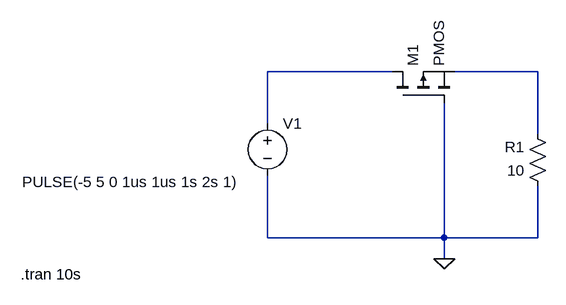
[diagram p0: schematic pmos.asc]
pmos.asc, the LTspice schematic file:
Version 4
SHEET 1 880 680
WIRE 304 -80 112 -80
WIRE 528 -80 400 -80
WIRE 112 0 112 -80
WIRE 528 16 528 -80
WIRE 112 176 112 80
WIRE 384 176 384 -32
WIRE 384 176 112 176
WIRE 528 176 528 96
WIRE 528 176 384 176
WIRE 384 208 384 176
FLAG 384 208 0
SYMBOL voltage 112 -16 R0
WINDOW 3 -378 106 Left 2
WINDOW 123 0 0 Left 2
WINDOW 39 0 0 Left 2
SYMATTR InstName V1
SYMATTR Value PULSE(-5 5 0 1us 1us 1s 2s 1)
SYMBOL res 544 112 R180
WINDOW 0 36 76 Left 2
WINDOW 3 36 40 Left 2
SYMATTR InstName R1
SYMATTR Value 10
SYMBOL pmos 304 -32 R270
SYMATTR InstName M1
TEXT -268 232 Left 2 !.tran 10s

The netlist it stands for:
* pmos.asc
V1 N001 0 PULSE(-5 5 0 1us 1us 1s 2s 1)
R1 0 N002 10
M1 N001 0 N002 N002 PMOS
.model NMOS NMOS
.model PMOS PMOS
.lib standard.mos
.tran 10s
.backanno
.end